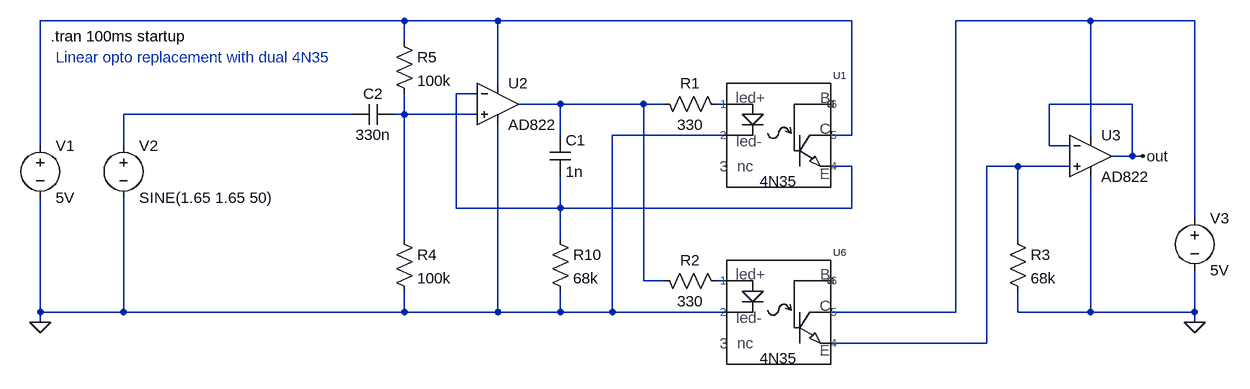
[diagram p0: schematic 4N35-jig.asc]
4N35-jig.asc, the LTspice schematic file:
Version 4
SHEET 1 880 720
WIRE -816 -48 -1376 -48
WIRE -672 -48 -816 -48
WIRE -128 -48 -672 -48
WIRE 240 -48 32 -48
WIRE 400 -48 240 -48
WIRE -816 -16 -816 -48
WIRE -672 48 -672 -48
WIRE -704 64 -736 64
WIRE -576 80 -640 80
WIRE -448 80 -576 80
WIRE -416 80 -448 80
WIRE -320 80 -336 80
WIRE 304 80 176 80
WIRE -896 96 -1248 96
WIRE -816 96 -816 64
WIRE -816 96 -832 96
WIRE -704 96 -816 96
WIRE -576 128 -576 80
WIRE -320 128 -496 128
WIRE -128 128 -128 -48
WIRE -128 128 -160 128
WIRE 240 128 240 -48
WIRE -1376 144 -1376 -48
WIRE -1248 144 -1248 96
WIRE 176 144 176 80
WIRE 208 144 176 144
WIRE 304 160 304 80
WIRE 304 160 272 160
WIRE 320 160 304 160
WIRE -128 176 -160 176
WIRE 128 176 80 176
WIRE 208 176 128 176
WIRE -736 240 -736 64
WIRE -576 240 -576 192
WIRE -576 240 -736 240
WIRE -128 240 -128 176
WIRE -128 240 -576 240
WIRE 400 256 400 -48
WIRE -816 288 -816 96
WIRE -576 288 -576 240
WIRE 128 288 128 176
WIRE -448 352 -448 80
WIRE -416 352 -448 352
WIRE -320 352 -336 352
WIRE -1376 400 -1376 224
WIRE -1248 400 -1248 224
WIRE -1248 400 -1376 400
WIRE -816 400 -816 368
WIRE -816 400 -1248 400
WIRE -672 400 -672 112
WIRE -672 400 -816 400
WIRE -576 400 -576 368
WIRE -576 400 -672 400
WIRE -496 400 -496 128
WIRE -496 400 -576 400
WIRE -320 400 -496 400
WIRE 32 400 32 -48
WIRE 32 400 -160 400
WIRE 128 400 128 368
WIRE 240 400 240 192
WIRE 240 400 128 400
WIRE 400 400 400 336
WIRE 400 400 240 400
WIRE -1376 416 -1376 400
WIRE 400 416 400 400
WIRE 80 448 80 176
WIRE 80 448 -160 448
FLAG 320 160 out
FLAG -1376 416 0
FLAG 400 416 0
SYMBOL res -432 64 M90
WINDOW 0 0 56 VBottom 2
WINDOW 3 32 56 VTop 2
SYMATTR InstName R1
SYMATTR Value 330
SYMBOL voltage -1376 128 R0
WINDOW 123 0 0 Left 2
WINDOW 39 0 0 Left 2
SYMATTR InstName V1
SYMATTR Value 5V
SYMBOL res 112 272 R0
SYMATTR InstName R3
SYMATTR Value 68k
SYMBOL voltage -1248 128 R0
WINDOW 123 0 0 Left 2
WINDOW 39 0 0 Left 2
SYMATTR InstName V2
SYMATTR Value SINE(1.65 1.65 50)
SYMBOL res -832 272 R0
SYMATTR InstName R4
SYMATTR Value 100k
SYMBOL res -832 -32 R0
SYMATTR InstName R5
SYMATTR Value 100k
SYMBOL cap -896 80 M90
WINDOW 0 0 32 VBottom 2
WINDOW 3 32 32 VTop 2
SYMATTR InstName C2
SYMATTR Value 330n
SYMBOL voltage 400 240 R0
WINDOW 123 0 0 Left 2
WINDOW 39 0 0 Left 2
SYMATTR InstName V3
SYMATTR Value 5V
SYMBOL Opamps\\AD822 -672 16 R0
SYMATTR InstName U2
SYMBOL res -592 272 R0
SYMATTR InstName R10
SYMATTR Value 68k
SYMBOL cap -592 128 R0
SYMATTR InstName C1
SYMATTR Value 1n
SYMBOL Opamps\\AD822 240 96 R0
SYMATTR InstName U3
SYMBOL res -432 336 M90
WINDOW 0 0 56 VBottom 2
WINDOW 3 32 56 VTop 2
SYMATTR InstName R2
SYMATTR Value 330
SYMBOL _PERSONAL\\opto\\4N35 -240 128 R0
SYMATTR InstName U1
SYMBOL _PERSONAL\\opto\\4N35 -240 400 R0
SYMATTR InstName U6
TEXT -1360 -24 Left 2 !.tran 100ms startup
TEXT -1352 8 Left 2 ;Linear opto replacement with dual 4N35

The netlist it stands for:
* 4N35-jig.asc
R1 N004 N005 330
V1 N001 0 5V
R3 N008 0 68k
V2 N006 0 SINE(1.65 1.65 50)
R4 N007 0 100k
R5 N001 N007 100k
C2 N006 N007 330n
V3 N002 0 5V
XU2 N007 N003 N001 0 N004 AD822  ; pins In+ In- V+ V- OUT
R10 N003 0 68k
C1 N004 N003 1n
XU3 N008 out N002 0 out AD822  ; pins In+ In- V+ V- OUT
R2 N004 N009 330
XU1 N005 0 N003 N001 NC_01 4N35 4N35 4N35  ; pins 1 2 4 5 6
XU6 N009 0 N008 N002 NC_02 4N35 4N35 4N35  ; pins 1 2 4 5 6
.tran 100ms startup
* Linear opto replacement with dual 4N35
.lib ..\sym\_PERSONAL\opto\4N35.sub
.backanno
.end